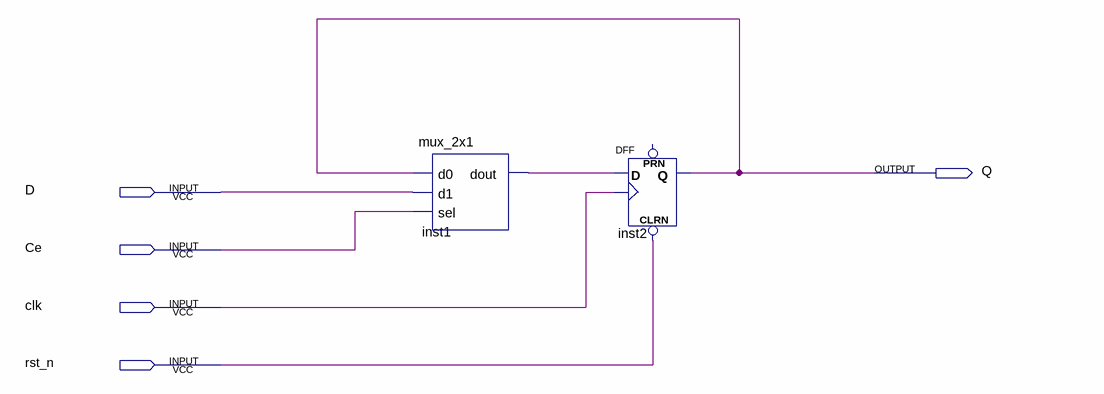
[diagram p0: schematic sheet]
// Quartus schematic reg_1bit.bdf as structural Verilog: 2 symbols, 5 pins
module reg_1bit (
  input  D,
  input  Ce,
  input  clk,
  input  rst_n,
  output Q
);

  wire inst1_dout;

  mux_2x1 inst1 (.d0(Q), .d1(D), .sel(Ce), .dout(inst1_dout));
  DFF inst2 (.CLRN(rst_n), .CLK(clk), .D(inst1_dout), .Q(Q));  // open: PRN
endmodule
